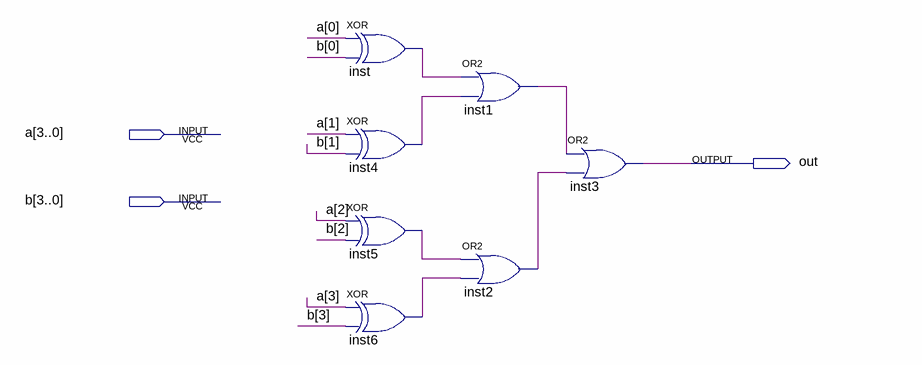
[diagram p0: schematic sheet]
// Quartus schematic eq_4bit.bdf as structural Verilog: 7 symbols, 3 pins
module eq_4bit (
  input  [3:0] a,
  input  [3:0] b,
  output out
);

  wire inst1_out, inst2_out, inst4_out, inst5_out, inst6_out, inst_out;

  xor inst (inst_out, a[0], b[0]);
  xor inst4 (inst4_out, a[1], b[1]);
  xor inst5 (inst5_out, a[2], b[2]);
  xor inst6 (inst6_out, a[3], b[3]);
  or inst1 (inst1_out, inst_out, inst4_out);
  or inst2 (inst2_out, inst5_out, inst6_out);
  or inst3 (out, inst1_out, inst2_out);
endmodule
